# EAGLE design DESIGN7MA (EAGLE 9.3.2)
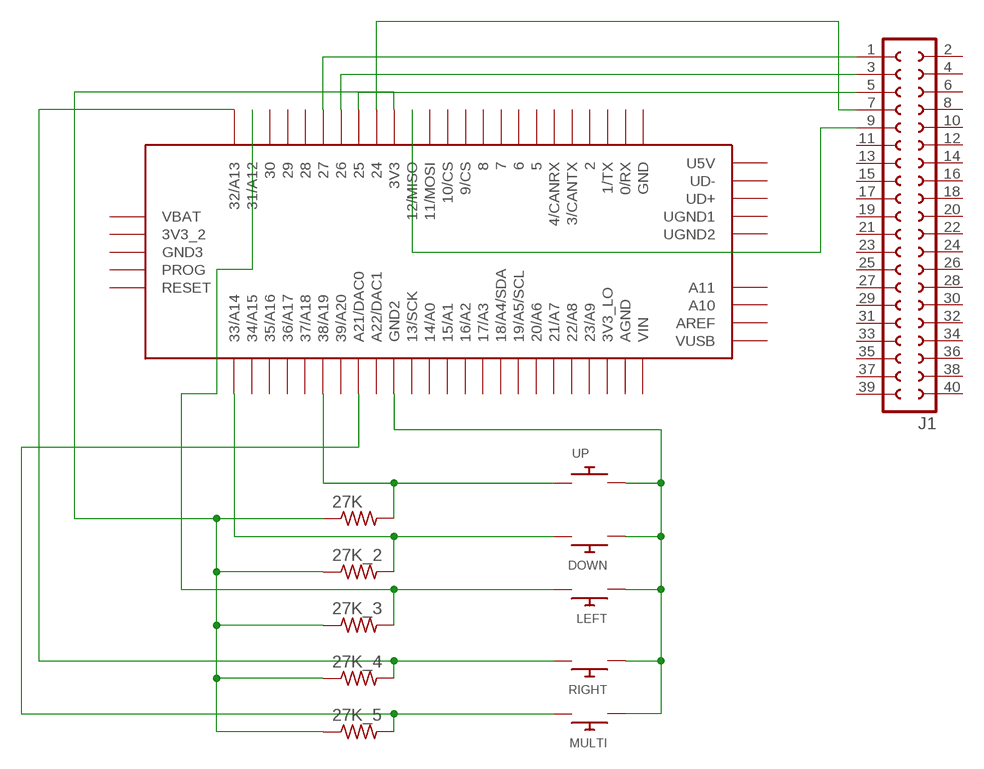
[diagram p0: schematic, sheet 1]

## Parts
27K  R-US_0204/5  [0204/5]
27K_2  R-US_0204/5  [0204/5]
27K_3  R-US_0204/5  [0204/5]
27K_4  R-US_0204/5  [0204/5]
27K_5  R-US_0204/5  [0204/5]
DOWN  SWITCH_PUSHBUTTONEVQ-PE  [TACT_PANA-EVQ]
J1  SOCKET-40V  [S40V]
LEFT  SWITCH_PUSHBUTTONEVQ-PE  [TACT_PANA-EVQ]
MULTI  SWITCH_PUSHBUTTONEVQ-PE  [TACT_PANA-EVQ]
RIGHT  SWITCH_PUSHBUTTONEVQ-PE  [TACT_PANA-EVQ]
U$1  TEENSY_3.5/3.6  [TEENSY_3.5/3.6]
UP  SWITCH_PUSHBUTTONEVQ-PE  [TACT_PANA-EVQ]

## Nets
N$1: DOWN.P$1 LEFT.P$1 MULTI.P$1 RIGHT.P$1 U$1.GND2 UP.P$2
N$2: J1.1 U$1.27
N$3: 27K_3.2 LEFT.P$2 U$1.31/A12
N$4: 27K_2.2 DOWN.P$2 U$1.33/A14
N$5: 27K_4.2 RIGHT.P$2 U$1.32/A13
N$7: 27K.1 27K_2.1 27K_3.1 27K_4.1 27K_5.1 U$1.3V3
N$8: J1.3 U$1.26
N$9: J1.5 U$1.25
N$10: J1.7 U$1.24
N$11: J1.9 U$1.12/MISO
N$12: 27K_5.2 MULTI.P$2 U$1.21/DAC0(A21/DAC0)
N$13: 27K.2 U$1.38/A19 UP.P$1
Unconnected: J1.2 J1.4 J1.6 J1.8 J1.10 J1.11 J1.12 J1.13 J1.14 J1.15 J1.16 J1.17 J1.18 J1.19 J1.20 J1.21 J1.22 J1.23 J1.24 J1.25 J1.26 J1.27 J1.28 J1.29 J1.30 J1.31 J1.32 J1.33 J1.34 J1.35 J1.36 J1.37 J1.38 J1.39 J1.40 U$1.0/RX U$1.1/TX U$1.2 U$1.3/CANTX U$1.3V3_2 U$1.3V3_LO U$1.4/CANRX U$1.5 U$1.6 U$1.7 U$1.8 U$1.9/CS U$1.10/CS U$1.11/MOSI U$1.13/SCK U$1.14/A0 U$1.15/A1 U$1.16/A2 U$1.17/A3 U$1.18/A4/SDA U$1.19/A5/SCL U$1.20/A6 U$1.21/A7 U$1.22/A8 U$1.23/A9 U$1.28 U$1.29 U$1.30 U$1.34/A15 U$1.35/A16 U$1.36/A17 U$1.37/A18 U$1.39/A20 U$1.A10 U$1.A11 U$1.A22/DAC1 U$1.AGND U$1.AREF U$1.GND U$1.GND3 U$1.PROG U$1.RESET U$1.U5V U$1.UD+ U$1.UD- U$1.UGND1 U$1.UGND2 U$1.VBAT U$1.VIN U$1.VUSB

## Library data of the parts
27K 27K_2-27K_5 = adafruit:R-US_: RESISTOR, American symbol
DOWN LEFT MULTI RIGHT UP = adafruit:SWITCH_PUSHBUTTON: Buttons SOFTTOUCHSMD_SJ - Soft touch temporary push button (Super Junk Akihabara) Compatible with SKPMANE010 [Mouser: 688-SKPMAN] C&K_KSS = Digikey: KSS221GLFS
J1 = con-3m-skt-header:SOCKET-40: 40 pin PCB Socket (3m 85xx/51xx)
U$1 = Teensy356:TEENSY_3.5/3.6

## Board
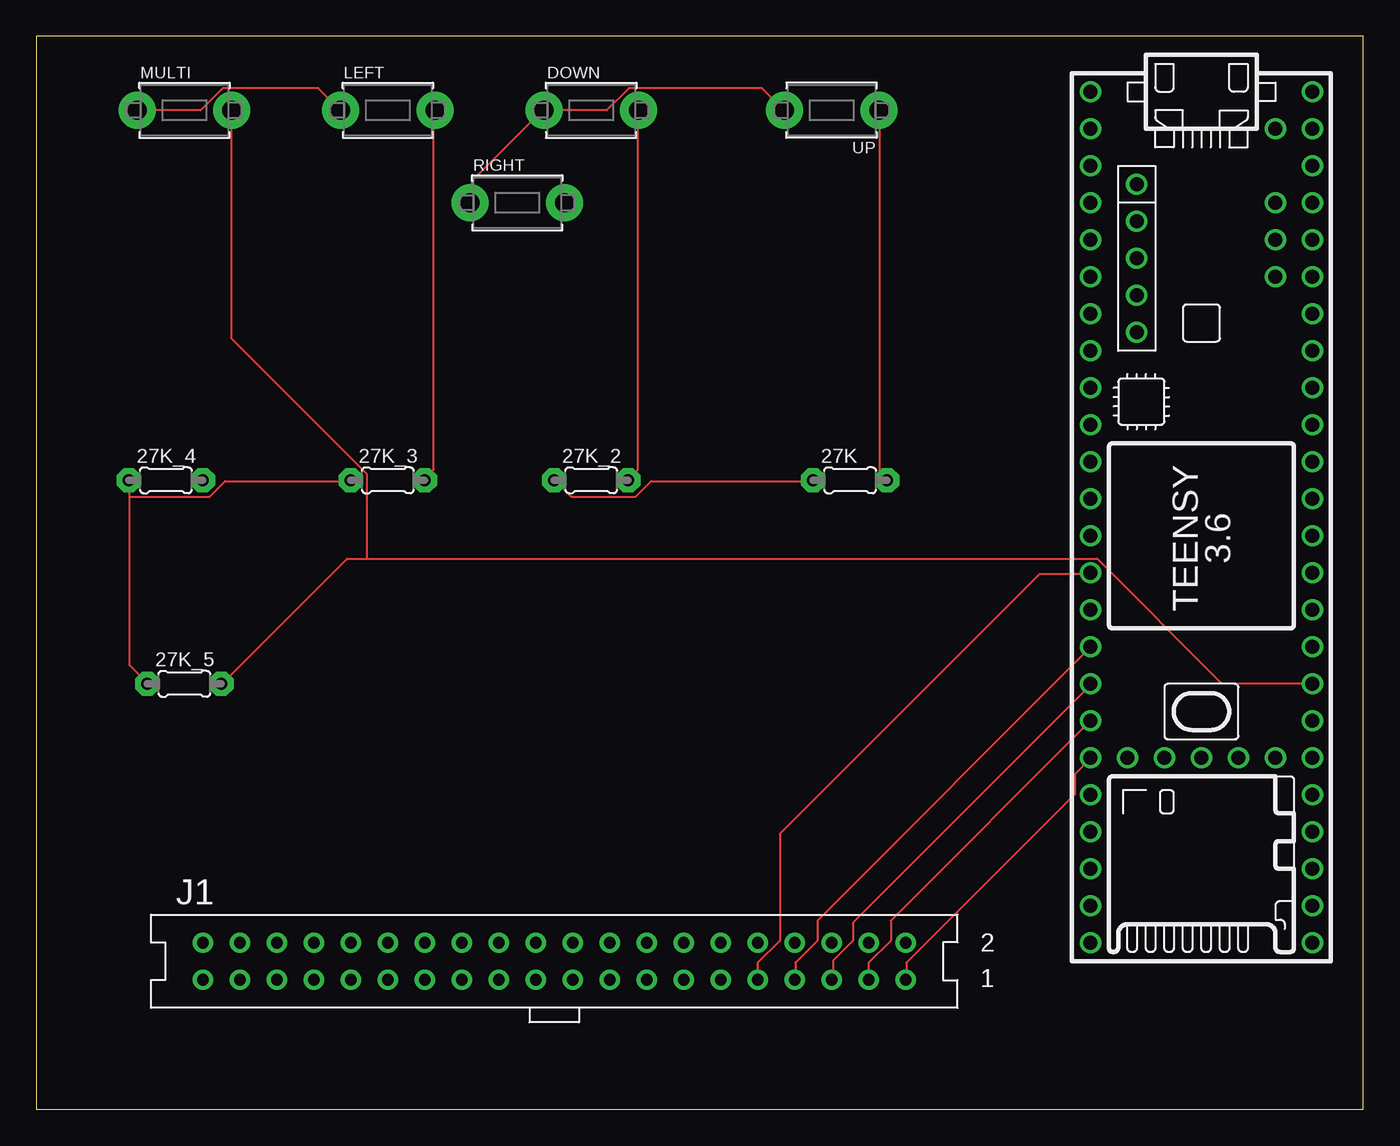
[diagram p1: board, top side]
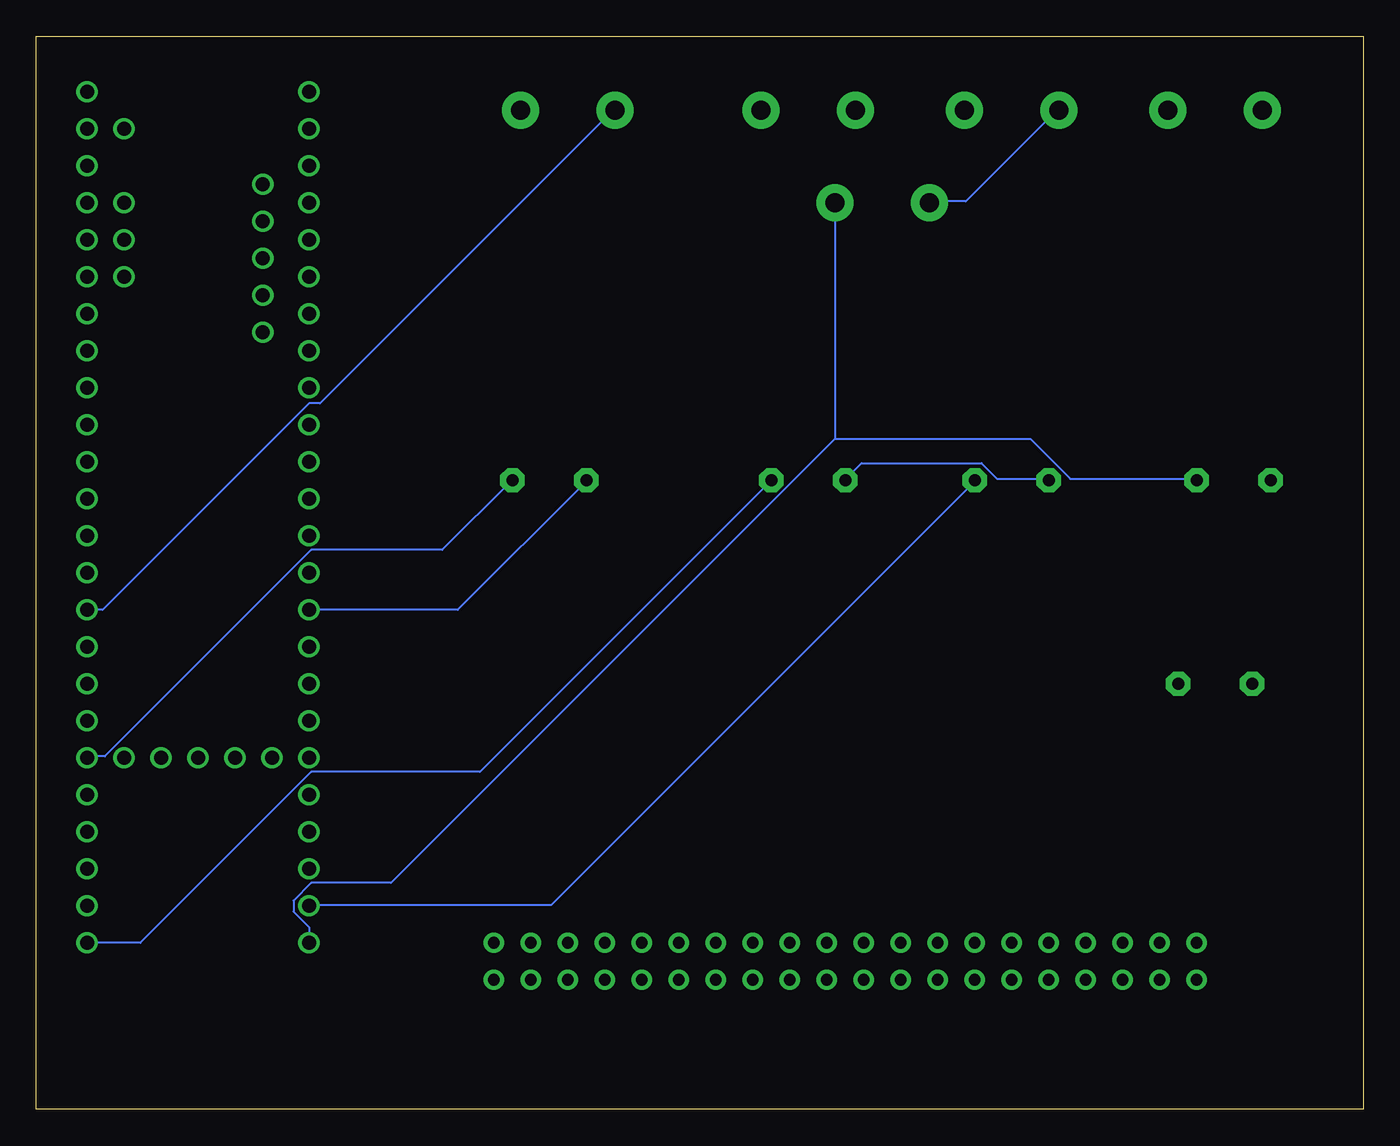
[diagram p2: board, bottom side, seen from below]

Size 91.11 x 73.65 mm. Coordinates in mm from the lower left corner, seen from the top.
Outline: 0,0 91.11,0 91.11,73.65 0,73.65 0,0
Copper layers (1*16): Top 0.035mm / dielectric 1.5mm / Bottom 0.035mm
Design rules "default": minimum track width 6mil, minimum drill 0.35mm, track to track 6mil, track to pad 6mil, pad to pad 6mil, via to via 6mil, smd to smd 6mil, copper to edge 40mil, drill to drill 6mil, minimum pad ring 10mil, minimum via ring 8mil, stop-mask expansion 4mil, vias tented up to drill 0mil, thermal gap 10mil

### Footprints (pad centres in the part's own frame; a part is rotated, then mirrored left to right if it is on the bottom)
0204/5 = drill 0.813 pad 1.676 octagon: 1 -2.54,0; 2 2.54,0
TACT_PANA-EVQ = drill 1.3 pad 2.54: P$1 -3.25,0; P$2 3.25,0
S40V = drill 0.8 pad 1.4: 1 24.13,-1.27; 2 24.13,1.27; 3 21.59,-1.27; 4 21.59,1.27; 5 19.05,-1.27; 6 19.05,1.27; 7 16.51,-1.27; 8 16.51,1.27; 9 13.97,-1.27; 10 13.97,1.27; 11 11.43,-1.27; 12 11.43,1.27; 13 8.89,-1.27; 14 8.89,1.27; 15 6.35,-1.27; 16 6.35,1.27; 17 3.81,-1.27; 18 3.81,1.27; 19 1.27,-1.27; 20 1.27,1.27; 21 -1.27,-1.27; 22 -1.27,1.27; 23 -3.81,-1.27; 24 -3.81,1.27; 25 -6.35,-1.27; 26 -6.35,1.27; 27 -8.89,-1.27; 28 -8.89,1.27; 29 -11.43,-1.27; 30 -11.43,1.27; 31 -13.97,-1.27; 32 -13.97,1.27; 33 -16.51,-1.27; 34 -16.51,1.27; 35 -19.05,-1.27; 36 -19.05,1.27; 37 -21.59,-1.27; 38 -21.59,1.27; 39 -24.13,-1.27; 40 -24.13,1.27
TEENSY_3.5/3.6 = drill 0.965: 0/RX -25.4,-7.62; 1/TX -22.86,-7.62; 2 -20.32,-7.62; 3/CANTX -17.78,-7.62; 3V3 7.62,-7.62; 3V3_2 17.78,-2.54; 3V3_LO -22.86,7.62; 4/CANRX -15.24,-7.62; 5 -12.7,-7.62; 6 -10.16,-7.62; 7 -7.62,-7.62; 8 -5.08,-7.62; 9/CS -2.54,-7.62; 10/CS 0,-7.62; 11/MOSI 2.54,-7.62; 12/MISO 5.08,-7.62; 13/SCK 5.08,7.62; 14/A0 2.54,7.62; 15/A1 0,7.62; 16/A2 -2.54,7.62; 17/A3 -5.08,7.62; 18/A4/SDA -7.62,7.62; 19/A5/SCL -10.16,7.62; 20/A6 -12.7,7.62; 21/A7 -15.24,7.62; 21/DAC0 12.7,7.62; 22/A8 -17.78,7.62; 23/A9 -20.32,7.62; 24 10.16,-7.62; 25 12.7,-7.62; 26 15.24,-7.62; 27 17.78,-7.62; 28 20.32,-7.62; 29 22.86,-7.62; 30 25.4,-7.62; 31/A12 27.94,-7.62; 32/A13 30.48,-7.62; 33/A14 30.48,7.62; 34/A15 27.94,7.62; 35/A16 25.4,7.62; 36/A17 22.86,7.62; 37/A18 20.32,7.62; 38/A19 17.78,7.62; 39/A20 15.24,7.62; A10 -17.78,5.08; A11 -15.24,5.08; A22/DAC1 10.16,7.62; AGND -25.4,7.62; AREF -20.32,5.08; GND -27.94,-7.62; GND2 7.62,7.62; GND3 17.78,0; PROG 17.78,2.54; RESET 17.78,5.08; U5V -21.59,-4.445; UD+ -16.51,-4.445; UD- -19.05,-4.445; UGND1 -13.97,-4.445; UGND2 -11.43,-4.445; VBAT 17.78,-5.08; VIN -27.94,7.62; VUSB -25.4,5.08

### Placement (x,y rotation side)
27K  55.88,43.18 0 top
27K_2  38.1,43.18 0 top
27K_3  24.13,43.18 0 top
27K_4  8.89,43.18 0 top
27K_5  10.16,29.21 0 top
DOWN  38.1,68.58 0 top
J1  35.56,10.16 0 top
LEFT  24.13,68.58 0 top
MULTI  10.16,68.58 0 top
RIGHT  33.02,62.23 0 top
U$1  80.01,41.91 270 top
UP  54.61,68.58 180 top

### Tracks (layer width: path | path; a pad name or v marks a point on that pad's centre or on a via)
N$1
  Top 0.152: RIGHT.P$1 29.87,62.33 29.87,63.7 34.75,68.58 DOWN.P$1 39.17,68.58 40.69,70.1 49.84,70.1 UP.P$2 | MULTI.P$1 11.28,68.58 12.8,70.1 19.36,70.1 LEFT.P$1
  Bottom 0.152: RIGHT.P$1 29.72,62.33 27.28,62.33 21.03,68.58 LEFT.P$1 | U$1.GND2 86.56,34.29 72.39,48.46 71.63,48.46 51.51,68.58 UP.P$2
N$2
  Top 0.152: J1.1 59.74,8.99 59.74,10.06 71.32,21.64 71.32,23.01 72.39,24.08 U$1.27
N$3
  Top 0.152: LEFT.P$2 27.28,68.58 27.28,43.89 26.67,43.28 27K_3.2
  Bottom 0.152: U$1.31/A12 72.39,14.02 55.78,14.02 26.67,43.13 27K_3.2
N$4
  Top 0.152: DOWN.P$2 41.3,68.58 41.3,43.89 40.69,43.28 27K_2.2
  Bottom 0.152: U$1.33/A14 83.97,11.43 72.24,23.16 60.66,23.16 27K_2.2
N$5
  Bottom 0.152: U$1.32/A13 72.39,12.5 73.46,13.56 73.46,14.33 72.24,15.54 66.75,15.54 36.27,46.02 | 36.27,46.02 36.27,62.18 RIGHT.P$2 | 36.27,46.02 22.86,46.02 20.12,43.28 11.43,43.28 27K_4.2
N$7
  Top 0.152: 6.4,42.06 6.4,30.48 7.62,29.26 27K_5.1 | 6.4,42.06 6.4,43.13 27K_4.1 | 6.4,42.06 11.89,42.06 12.95,43.13 21.49,43.13 27K_3.1 | 27K.1 53.34,43.13 42.22,43.13 41.15,42.06 36.73,42.06 35.66,43.13 27K_2.1
  Bottom 0.152: U$1.3V3 62.18,34.29 53.34,43.13 27K.1 | 27K_3.1 21.64,43.28 25.15,43.28 26.21,44.35 34.44,44.35 35.51,43.28 27K_2.1
N$8
  Top 0.152: J1.3 57.15,10.06 58.67,11.58 58.67,12.95 U$1.26
N$9
  Top 0.152: J1.5 54.71,8.99 54.71,10.21 56.08,11.58 56.08,12.8 72.39,29.11 U$1.25
N$10
  Top 0.152: J1.7 52.12,8.99 52.12,10.06 53.65,11.58 53.65,12.95 72.39,31.7 U$1.24
N$11
  Top 0.152: J1.9 49.53,10.06 51.05,11.58 51.05,18.9 68.89,36.73 72.39,36.73 U$1.12/MISO
N$12
  Top 0.152: 22.71,37.8 21.34,37.8 12.8,29.26 27K_5.2 | 22.71,37.8 72.85,37.8 81.38,29.26 87.63,29.26 U$1.21/DAC0 | 22.71,37.8 22.71,43.59 13.41,52.88 MULTI.P$2
N$13
  Top 0.152: UP.P$1 57.91,68.58 57.91,43.74 58.37,43.28 27K.2
  Bottom 0.152: U$1.38/A19 87.63,24.23 86.41,24.23 72.24,38.41 63.25,38.41 58.52,43.13 27K.2